# EAGLE schematic USB2LPT_1.7_adapter (EAGLE 7.5.0)
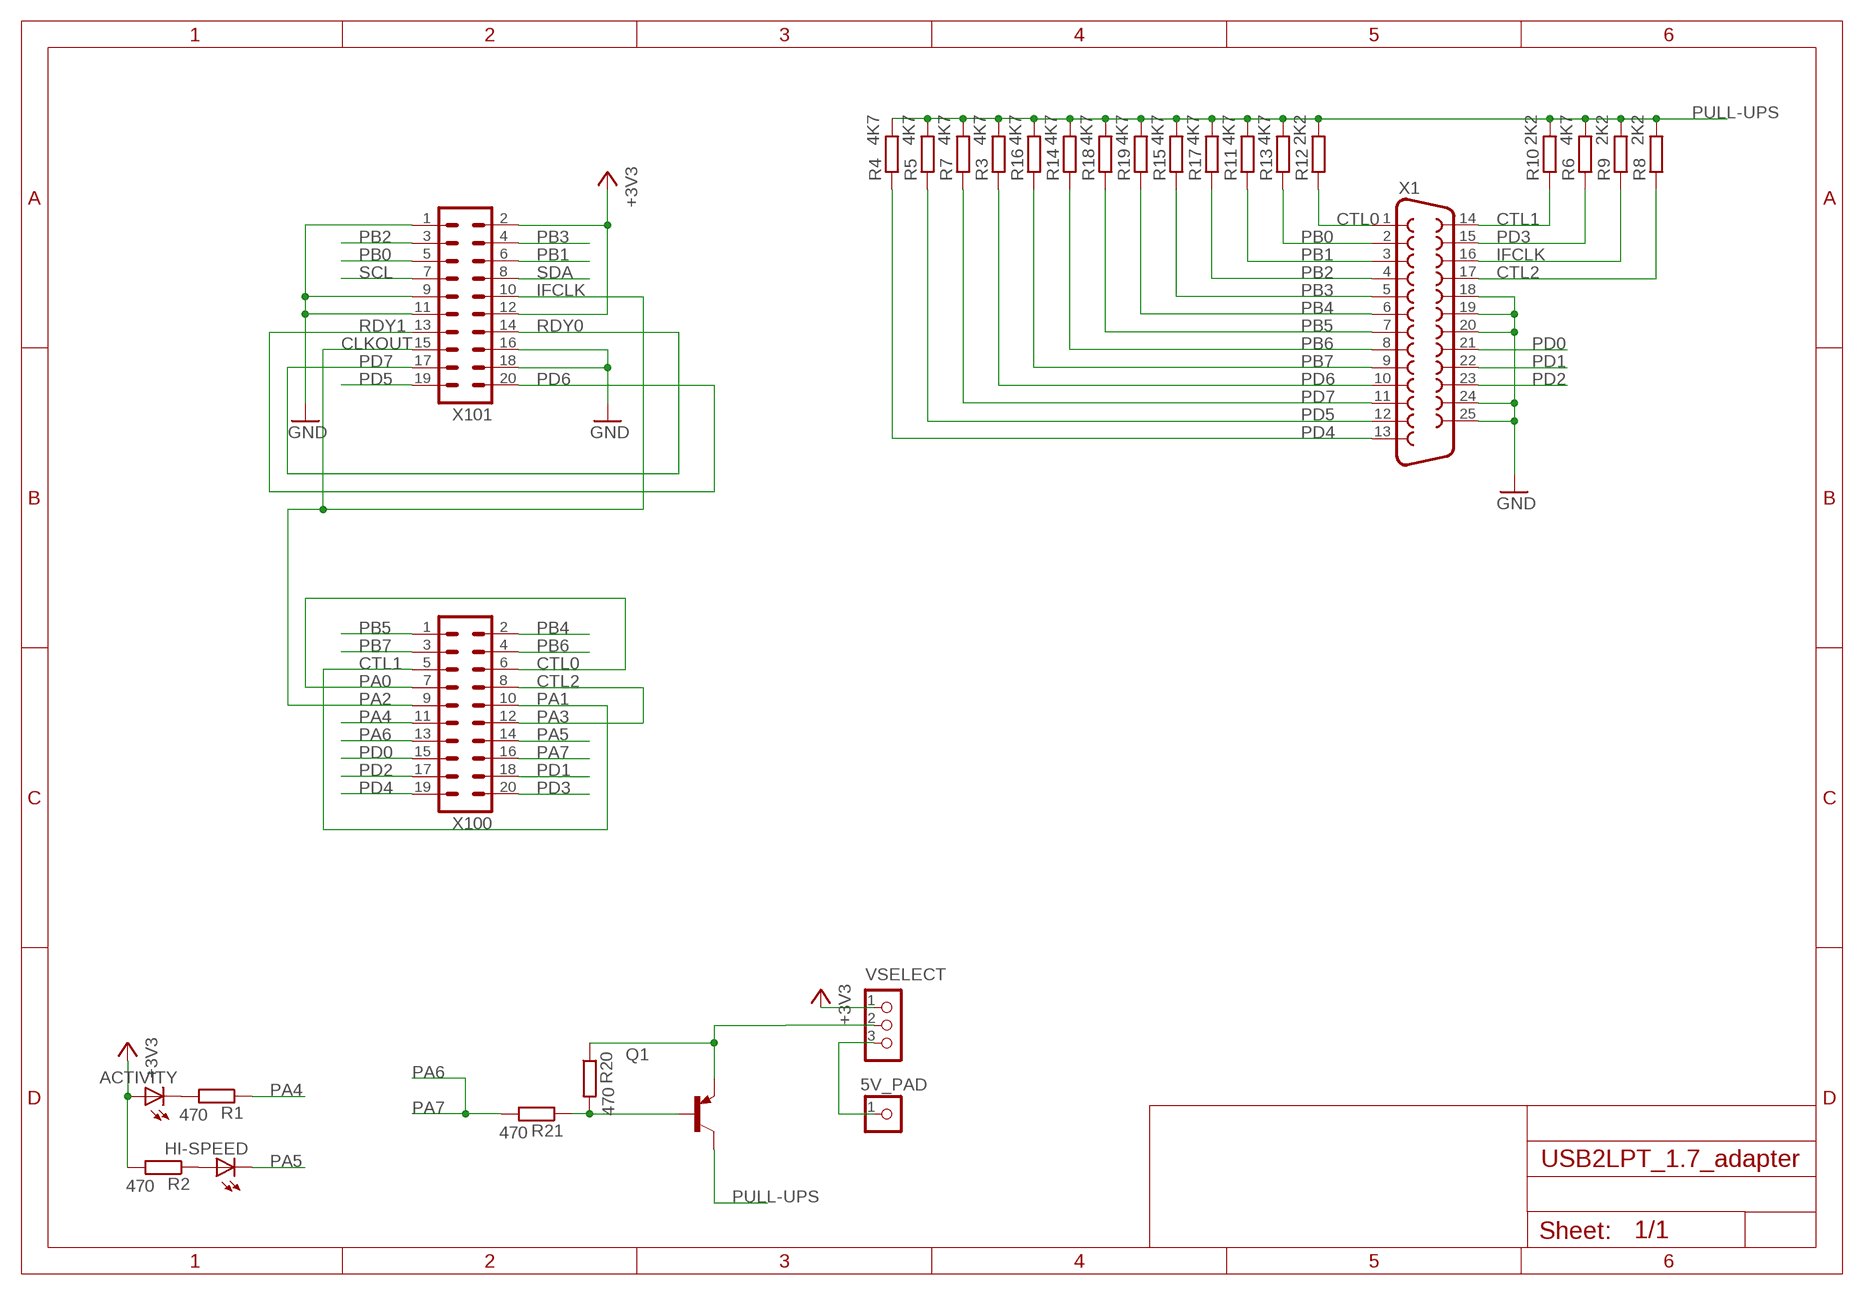
[diagram p0: schematic, sheet 1]

## Parts
+5V  CON_HEADER_1X01-PTH_08_17  [M1X2_08_17]
ACTIVITY  LED-0805  [LED-805]
HI-SPEED  LED-0805  [LED-805]
Q1  TRANSISTOR_BJT_PNP-SOT-23-BEC  [SOT-23]
R1  470  RESISTORR805-0805  [R805]
R2  470  RESISTORR805-0805  [R805]
R3  4K7  RESISTORR805-0805  [R805]
R4  4K7  RESISTORR805-0805  [R805]
R5  4K7  RESISTORR805-0805  [R805]
R6  4K7  RESISTORR805-0805  [R805]
R7  4K7  RESISTORR805-0805  [R805]
R8  2K2  RESISTORR805-0805  [R805]
R9  2K2  RESISTORR805-0805  [R805]
R10  2K2  RESISTORR805-0805  [R805]
R11  4K7  RESISTORR805-0805  [R805]
R12  2K2  RESISTORR805-0805  [R805]
R13  4K7  RESISTORR805-0805  [R805]
R14  4K7  RESISTORR805-0805  [R805]
R15  4K7  RESISTORR805-0805  [R805]
R16  4K7  RESISTORR805-0805  [R805]
R17  4K7  RESISTORR805-0805  [R805]
R18  4K7  RESISTORR805-0805  [R805]
R19  4K7  RESISTORR805-0805  [R805]
R20  470  RESISTORR805-0805  [R805]
R21  470  RESISTORR805-0805  [R805]
VSELECT  VSELECT_HEADER  [HEADER_1X3]
X1  F25D  [F25D]
X100  MA10-2  [MA10-2]
X101  MA10-2  [MA10-2]

## Nets
5V_PAD: +5V.1 VSELECT.3
+3V3: ACTIVITY.A R2.2 VSELECT.1 X101.2 X101.12
CTL0: R12.1 X1.1 X100.6 X100.7
CTL1: R10.1 X1.14 X100.5 X100.10
CTL2: R8.1 X1.17 X100.8 X100.12
GND: X1.18 X1.19 X1.20 X1.24 X1.25 X101.1 X101.9 X101.11 X101.16 X101.18
IFCLK: R9.1 X1.16 X100.9 X101.10 X101.15
N$1: HI-SPEED.A R2.1
N$5: ACTIVITY.C R1.2
N$8: Q1.1(B) R20.2 R21.1
PA4: R1.1 X100.11
PA5: HI-SPEED.C X100.14
PA6: R21.2 X100.13 X100.16
PB0: R13.1 X1.2 X101.5
PB1: R11.1 X1.3 X101.6
PB2: R17.1 X1.4 X101.3
PB3: R15.1 X1.5 X101.4
PB4: R19.1 X1.6 X100.2
PB5: R18.1 X1.7 X100.1
PB6: R14.1 X1.8 X100.4
PB7: R16.1 X1.9 X100.3
PD0: X1.21 X100.15
PD1: X1.22 X100.18
PD2: X1.23 X100.17
PD3: R6.1 X1.15 X100.20
PD4: R4.1 X1.13 X100.19
PD5: R5.1 X1.12 X101.19
PD6: R3.1 X1.10 X101.13 X101.20
PD7: R7.1 X1.11 X101.14 X101.17
PULL-UPS: Q1.3(C) R3.2 R4.2 R5.2 R6.2 R7.2 R8.2 R9.2 R10.2 R11.2 R12.2 R13.2 R14.2 R15.2 R16.2 R17.2 R18.2 R19.2
SCL: X101.7
SDA: X101.8
VSELECT: Q1.2(E) R20.1 VSELECT.2

## Notes on the sheet
- RDY1 | RDY0
- CLKOUT
- PA0
- PA2 | PA1
- PA3
- PA7
- PA7

## Library data of the parts
+5V = dp_devices:CON_HEADER_1X01
ACTIVITY HI-SPEED = dp_devices:LED: Light Emitting Diode
Q1 = dp_devices:TRANSISTOR_BJT_PNP: Most commonly used is SOT23-BEC
R1-R21 = dp_devices:RESISTOR
VSELECT = parts:VSELECT_HEADER
X1 = con-subd:F25: SUB-D; OC_FARNELL: unknown; OC_NEWARK: unknown
X100 X101 = con-lstb:MA10-2: PIN HEADER